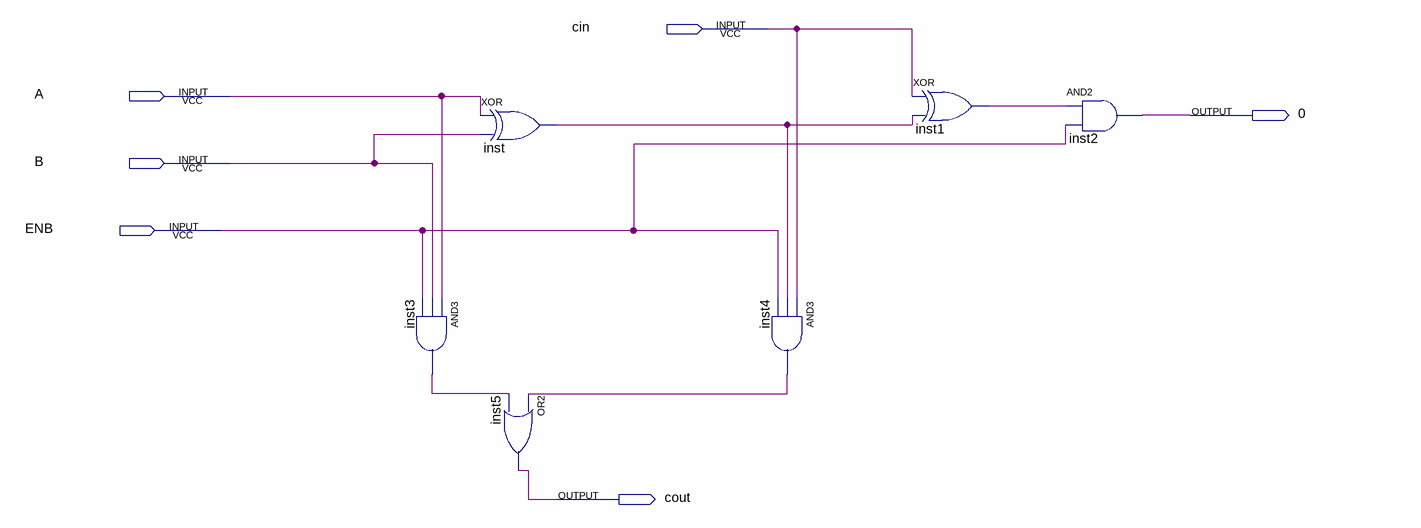
[diagram p0: schematic sheet]
// Quartus schematic FULL_ADDER_1BIT.bdf as structural Verilog: 6 symbols, 6 pins
module FULL_ADDER_1BIT (
  input  cin,
  input  A,
  input  B,
  input  ENB,
  output \0 ,
  output cout
);

  wire inst1_out, inst3_out, inst4_out, inst_out;

  and inst3 (inst3_out, A, B, ENB);
  xor inst (inst_out, A, B);
  or inst5 (cout, inst4_out, inst3_out);
  and inst4 (inst4_out, cin, inst_out, ENB);
  xor inst1 (inst1_out, cin, inst_out);
  and inst2 (\0 , inst1_out, ENB);
endmodule
